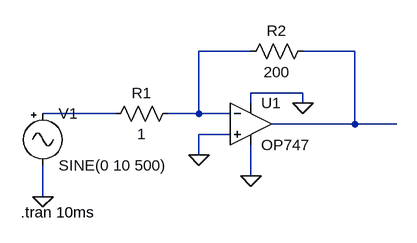
[diagram p0: schematic non-inverting schmit trigger.asc]
non-inverting schmit trigger.asc, the LTspice schematic file:
Version 4
SHEET 1 880 680
WIRE 240 32 160 32
WIRE 400 32 320 32
WIRE 320 96 240 96
WIRE 240 112 240 96
WIRE 320 112 320 96
WIRE 32 128 -80 128
WIRE 160 128 160 32
WIRE 160 128 112 128
WIRE 208 128 160 128
WIRE 400 144 400 32
WIRE 400 144 272 144
WIRE 464 144 400 144
WIRE 208 160 160 160
WIRE 160 192 160 160
WIRE 240 224 240 176
WIRE -80 256 -80 208
FLAG 160 192 0
FLAG -80 256 0
FLAG 320 112 0
FLAG 240 224 0
SYMBOL res 128 112 R90
WINDOW 0 0 56 VBottom 2
WINDOW 3 32 56 VTop 2
SYMATTR InstName R1
SYMATTR Value 1
SYMBOL res 336 16 R90
WINDOW 0 0 56 VBottom 2
WINDOW 3 32 56 VTop 2
SYMATTR InstName R2
SYMATTR Value 200
SYMBOL Misc\\signal -80 112 R0
WINDOW 123 0 0 Left 0
WINDOW 39 0 0 Left 0
SYMATTR InstName V1
SYMATTR Value SINE(0 10 500)
SYMBOL Opamps\\OP747 240 80 R0
SYMATTR InstName U1
TEXT -114 280 Left 2 !.tran 10ms

The netlist it stands for:
* non-inverting schmit trigger.asc
R1 N001 N003 1
R2 N002 N001 200
V1 N003 0 SINE(0 10 500)
XU1 0 N001 0 0 N002 OP747  ; pins In+ In- V+ V- OUT
.tran 10ms
.backanno
.end